# EAGLE design Precision Arduino (EAGLE 5.11)
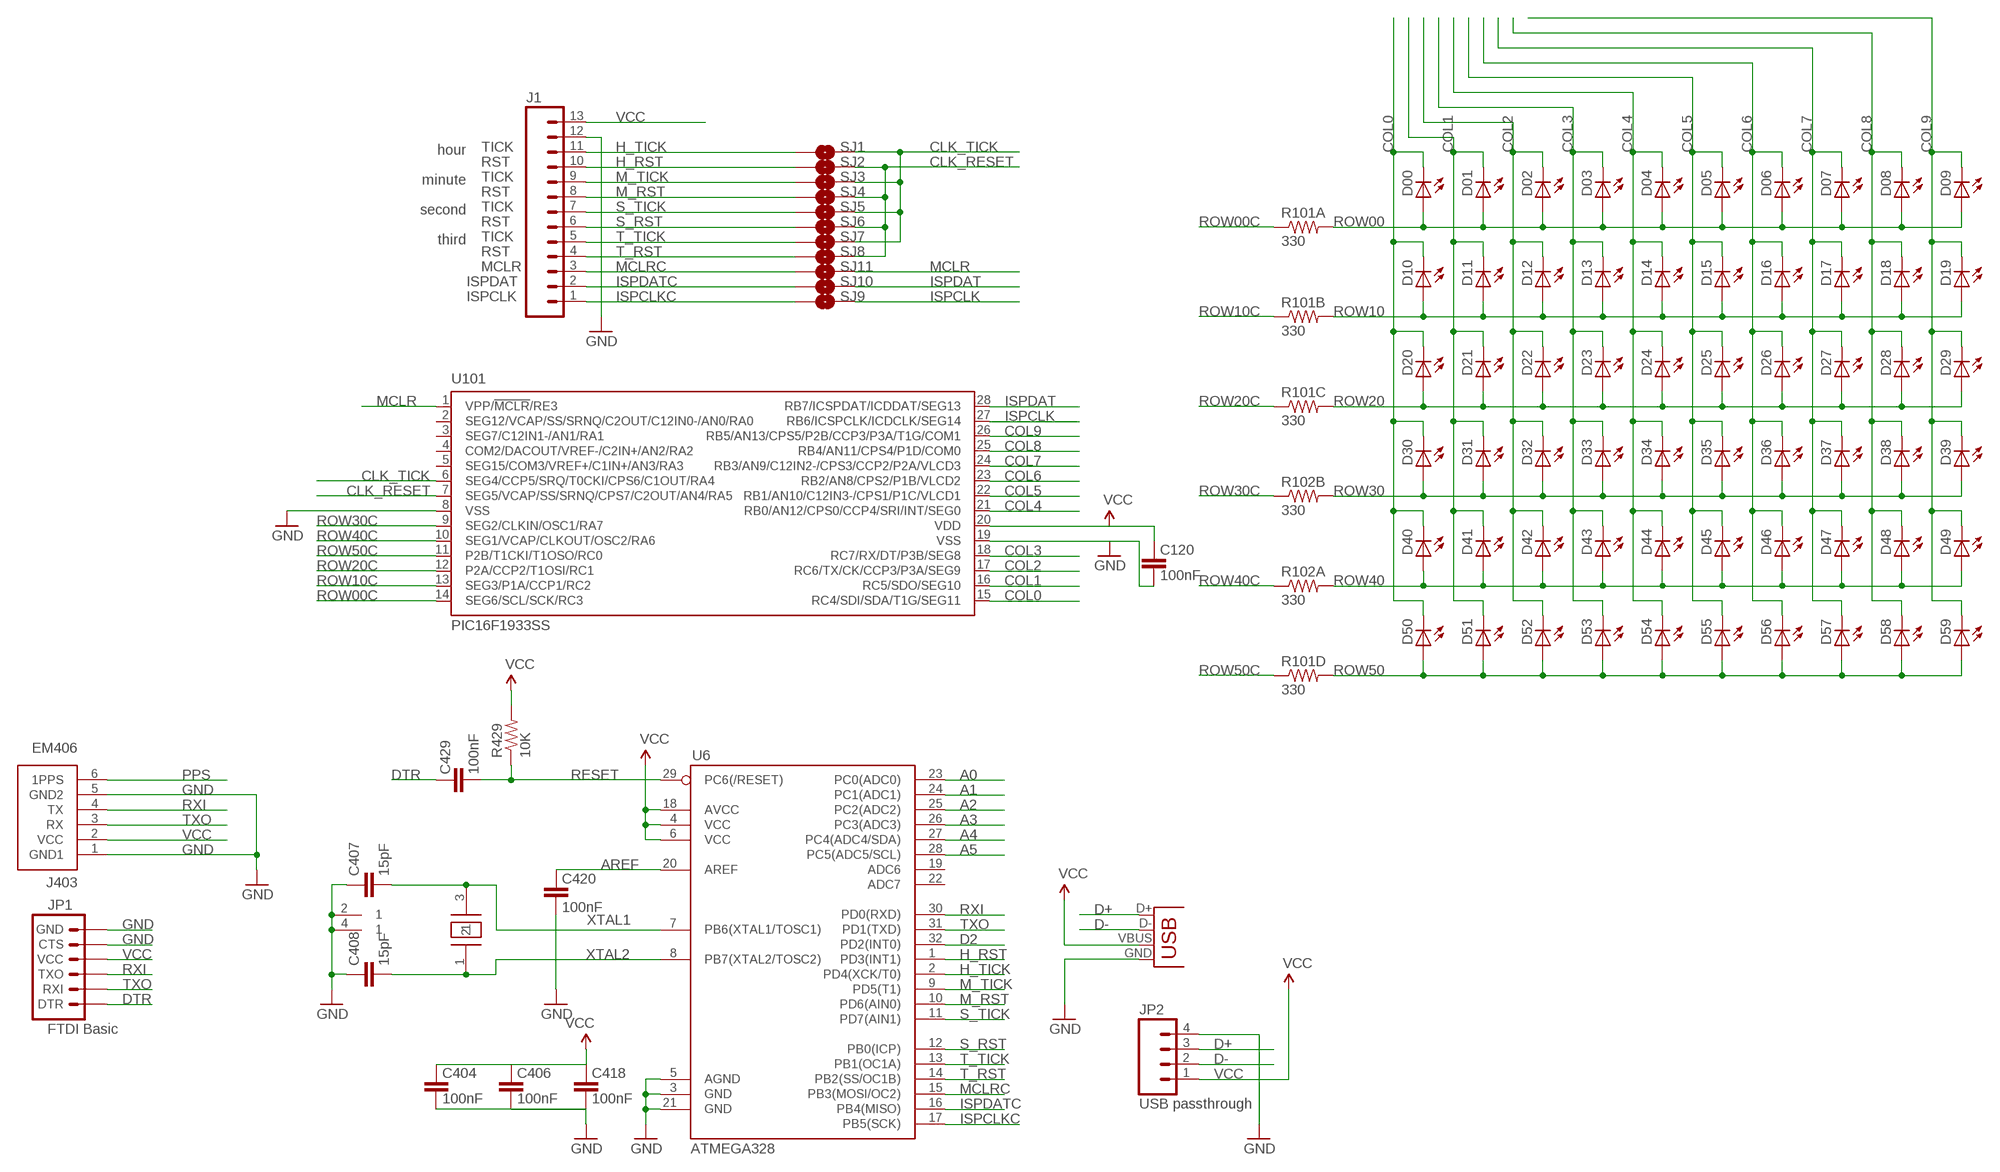
[diagram p0: schematic, sheet 1]

## Parts
C120  100nF  CAP0402-CAP  [0402-CAP]
C404  100nF  CAP0402-CAP  [0402-CAP]
C406  100nF  CAP0402-CAP  [0402-CAP]
C407  15pF  CAP0402-CAP  [0402-CAP]
C408  15pF  CAP0402-CAP  [0402-CAP]
C418  100nF  CAP0402-CAP  [0402-CAP]
C420  100nF  CAP0402-CAP  [0402-CAP]
C429  100nF  CAP0402-CAP  [0402-CAP]
D00  LED3MM  [LED3MM]
D01  LED3MM  [LED3MM]
D02  LED3MM  [LED3MM]
D03  LED3MM  [LED3MM]
D04  LED3MM  [LED3MM]
D05  LED3MM  [LED3MM]
D06  LED3MM  [LED3MM]
D07  LED3MM  [LED3MM]
D08  LED3MM  [LED3MM]
D09  LED3MM  [LED3MM]
D10  LED3MM  [LED3MM]
D11  LED3MM  [LED3MM]
D12  LED3MM  [LED3MM]
D13  LED3MM  [LED3MM]
D14  LED3MM  [LED3MM]
D15  LED3MM  [LED3MM]
D16  LED3MM  [LED3MM]
D17  LED3MM  [LED3MM]
D18  LED3MM  [LED3MM]
D19  LED3MM  [LED3MM]
D20  LED3MM  [LED3MM]
D21  LED3MM  [LED3MM]
D22  LED3MM  [LED3MM]
D23  LED3MM  [LED3MM]
D24  LED3MM  [LED3MM]
D25  LED3MM  [LED3MM]
D26  LED3MM  [LED3MM]
D27  LED3MM  [LED3MM]
D28  LED3MM  [LED3MM]
D29  LED3MM  [LED3MM]
D30  LED3MM  [LED3MM]
D31  LED3MM  [LED3MM]
D32  LED3MM  [LED3MM]
D33  LED3MM  [LED3MM]
D34  LED3MM  [LED3MM]
D35  LED3MM  [LED3MM]
D36  LED3MM  [LED3MM]
D37  LED3MM  [LED3MM]
D38  LED3MM  [LED3MM]
D39  LED3MM  [LED3MM]
D40  LED3MM  [LED3MM]
D41  LED3MM  [LED3MM]
D42  LED3MM  [LED3MM]
D43  LED3MM  [LED3MM]
D44  LED3MM  [LED3MM]
D45  LED3MM  [LED3MM]
D46  LED3MM  [LED3MM]
D47  LED3MM  [LED3MM]
D48  LED3MM  [LED3MM]
D49  LED3MM  [LED3MM]
D50  LED3MM  [LED3MM]
D51  LED3MM  [LED3MM]
D52  LED3MM  [LED3MM]
D53  LED3MM  [LED3MM]
D54  LED3MM  [LED3MM]
D55  LED3MM  [LED3MM]
D56  LED3MM  [LED3MM]
D57  LED3MM  [LED3MM]
D58  LED3MM  [LED3MM]
D59  LED3MM  [LED3MM]
J1  M13  [1X13]
J403  EM406  [EM406]
JP1  FTDI Basic  ARDUINO_SERIAL_PROGRAMPTH  [1X06]
JP2  USB passthrough  M04PTH  [1X04]
R101  330  CRA06S-8  [RP4]
R102  330  CRA06S-8  [RP4]
R429  10K  RESISTOR0402-RES  [0402-RES]
SJ1  SOLDERJUMPERNO  [SJ_2S-NO]
SJ2  SOLDERJUMPERNO  [SJ_2S-NO]
SJ3  SOLDERJUMPERNO  [SJ_2S-NO]
SJ4  SOLDERJUMPERNO  [SJ_2S-NO]
SJ5  SOLDERJUMPERNO  [SJ_2S-NO]
SJ6  SOLDERJUMPERNO  [SJ_2S-NO]
SJ7  SOLDERJUMPERNO  [SJ_2S-NO]
SJ8  SOLDERJUMPERNO  [SJ_2S-NO]
SJ9  SOLDERJUMPERNO  [SJ_2S-NO]
SJ10  SOLDERJUMPERNO  [SJ_2S-NO]
SJ11  SOLDERJUMPERNO  [SJ_2S-NO]
U6  ATMEGA328  ATMEGA168  [TQFP32-08]
U101  PIC16F1933SS  [SSOP28]
X1  USB-MICROB  [USB-MICROB]
Y401  TSX-3225  [CRYSTAL_SMD]

## Nets
A0: U6.23(PC0(ADC0))
A1: U6.24(PC1(ADC1))
A2: U6.25(PC2(ADC2))
A3: U6.26(PC3(ADC3))
A4: U6.27(PC4(ADC4/SDA))
A5: U6.28(PC5(ADC5/SCL))
AREF: C420.2 U6.20(AREF)
CLK_RESET: SJ2.2 SJ4.2 SJ6.2 SJ8.2 U101.7(SEG5/VCAP/SS/SRNQ/CPS7/C2OUT/AN4/RA5)
CLK_TICK: SJ1.2 SJ3.2 SJ5.2 SJ7.2 U101.6(SEG4/CCP5/SRQ/T0CKI/CPS6/C1OUT/RA4)
COL0: D00.K(C) D10.K(C) D20.K(C) D30.K(C) D40.K(C) D50.K(C) U101.15(RC4/SDI/SDA/T1G/SEG11)
COL1: D01.K(C) D11.K(C) D21.K(C) D31.K(C) D41.K(C) D51.K(C) U101.16(RC5/SDO/SEG10)
COL2: D02.K(C) D12.K(C) D22.K(C) D32.K(C) D42.K(C) D52.K(C) U101.17(RC6/TX/CK/CCP3/P3A/SEG9)
COL3: D03.K(C) D13.K(C) D23.K(C) D33.K(C) D43.K(C) D53.K(C) U101.18(RC7/RX/DT/P3B/SEG8)
COL4: D04.K(C) D14.K(C) D24.K(C) D34.K(C) D44.K(C) D54.K(C) U101.21(RB0/AN12/CPS0/CCP4/SRI/INT/SEG0)
COL5: D05.K(C) D15.K(C) D25.K(C) D35.K(C) D45.K(C) D55.K(C) U101.22(RB1/AN10/C12IN3-/CPS1/P1C/VLCD1)
COL6: D06.K(C) D16.K(C) D26.K(C) D36.K(C) D46.K(C) D56.K(C) U101.23(RB2/AN8/CPS2/P1B/VLCD2)
COL7: D07.K(C) D17.K(C) D27.K(C) D37.K(C) D47.K(C) D57.K(C) U101.24(RB3/AN9/C12IN2-/CPS3/CCP2/P2A/VLCD3)
COL8: D08.K(C) D18.K(C) D28.K(C) D38.K(C) D48.K(C) D58.K(C) U101.25(RB4/AN11/CPS4/P1D/COM0)
COL9: D09.K(C) D19.K(C) D29.K(C) D39.K(C) D49.K(C) D59.K(C) U101.26(RB5/AN13/CPS5/P2B/CCP3/P3A/T1G/COM1)
D2: U6.32(PD2(INT0))
D+: JP2.3 X1.D+
D-: JP2.2 X1.D-
DTR: C429.2 JP1.1(DTR)
GND [power]: C120.1 C404.1 C406.1 C407.1 C408.1 C418.1 C420.1 J1.12 J403.1(GND1) J403.5(GND2) JP1.5(CTS) JP1.6(GND) JP2.4 U6.3(GND) U6.5(AGND) U6.21(GND) U101.8(VSS) U101.19(VSS) X1.GND Y401.2 Y401.4
H_RST: J1.10 SJ2.1 U6.1(PD3(INT1))
H_TICK: J1.11 SJ1.1 U6.2(PD4(XCK/T0))
ISPCLK: SJ9.2 U101.27(RB6/ICSPCLK/ICDCLK/SEG14)
ISPCLKC: J1.1 SJ9.1 U6.17(PB5(SCK))
ISPDAT: SJ10.2 U101.28(RB7/ICSPDAT/ICDDAT/SEG13)
ISPDATC: J1.2 SJ10.1 U6.16(PB4(MISO))
M_RST: J1.8 SJ4.1 U6.10(PD6(AIN0))
M_TICK: J1.9 SJ3.1 U6.9(PD5(T1))
MCLR: SJ11.2 U101.1(VPP/!MCLR!/RE3)
MCLRC: J1.3 SJ11.1 U6.15(PB3(MOSI/OC2))
PPS: J403.6(1PPS)
RESET: C429.1 R429.1 U6.29(PC6(/RESET))
ROW00: D00.A D01.A D02.A D03.A D04.A D05.A D06.A D07.A D08.A D09.A R101.8
ROW00C: R101.1 U101.14(SEG6/SCL/SCK/RC3)
ROW10: D10.A D11.A D12.A D13.A D14.A D15.A D16.A D17.A D18.A D19.A R101.7
ROW10C: R101.2 U101.13(SEG3/P1A/CCP1/RC2)
ROW20: D20.A D21.A D22.A D23.A D24.A D25.A D26.A D27.A D28.A D29.A R101.6
ROW20C: R101.3 U101.12(P2A/CCP2/T1OSI/RC1)
ROW30: D30.A D31.A D32.A D33.A D34.A D35.A D36.A D37.A D38.A D39.A R102.7
ROW30C: R102.2 U101.9(SEG2/CLKIN/OSC1/RA7)
ROW40: D40.A D41.A D42.A D43.A D44.A D45.A D46.A D47.A D48.A D49.A R102.8
ROW40C: R102.1 U101.10(SEG1/VCAP/CLKOUT/OSC2/RA6)
ROW50: D50.A D51.A D52.A D53.A D54.A D55.A D56.A D57.A D58.A D59.A R101.5
ROW50C: R101.4 U101.11(P2B/T1CKI/T1OSO/RC0)
RXI: J403.4(TX) JP1.3(TXO) U6.30(PD0(RXD))
S_RST: J1.6 SJ6.1 U6.12(PB0(ICP))
S_TICK: J1.7 SJ5.1 U6.11(PD7(AIN1))
T_RST: J1.4 SJ8.1 U6.14(PB2(SS/OC1B))
T_TICK: J1.5 SJ7.1 U6.13(PB1(OC1A))
TXO: J403.3(RX) JP1.2(RXI) U6.31(PD1(TXD))
VCC [power]: C120.2 C404.2 C406.2 C418.2 J1.13 J403.2(VCC) JP1.4(VCC) JP2.1 R429.2 U6.4(VCC) U6.6(VCC) U6.18(AVCC) U101.20(VDD) X1.VBUS
XTAL1: C407.2 U6.7(PB6(XTAL1/TOSC1)) Y401.3
XTAL2: C408.2 U6.8(PB7(XTAL2/TOSC2)) Y401.1
Unconnected: R102.3 R102.4 R102.5 R102.6 U6.19(ADC6) U6.22(ADC7) U101.2(SEG12/VCAP/SS/SRNQ/C2OUT/C12IN0-/AN0/RA0) U101.3(SEG7/C12IN1-/AN1/RA1) U101.4(COM2/DACOUT/VREF-/C2IN+/AN2/RA2) U101.5(SEG15/COM3/VREF+/C1IN+/AN3/RA3)

## Notes on the sheet
- hour
- TICK
- RST
- minute
- TICK
- RST
- second
- TICK
- RST
- third
- TICK
- RST
- MCLR
- ISPDAT
- ISPCLK

## Library data of the parts
C120 C404 C406-C408 C418 C420 C429 = SparkFun:CAP: Capacitor Standard 0603 ceramic capacitor, and 0.1" leaded capacitor.
D00 D01-D09 D10-D59 = SparkFun:LED: LEDs Standard schematic elements and footprints for 5mm, 3mm, 1206, and 0603 sized LEDs. 5mm - Spark Fun Electronics SKU : COM-00529 (and others)
J1 = SparkFun:M13
J403 = SparkFun:EM406: EM406 Connector Proven layout and schematic for EM406 connector. Spark Fun Electronics SKU : GPS-00579
JP1 = SparkFun:ARDUINO_SERIAL_PROGRAM
JP2 = SparkFun:M04: Header 4 Standard 4-pin 0.1" header. Use with straight break away headers (SKU : PRT-00116), right angle break away headers (PRT-00553), swiss pins (PRT-00743), machine pins (PRT-00117), and female headers (PRT-00115). Molex polarized connector foot print use with SKU : PRT-08231 with associated crimp pins and housings. 1MM SMD Version SKU: PRT-10208
R101 R102 = KwanSystems:CRA06S-8
R429 = SparkFun:RESISTOR: Resistor Basic schematic elements and footprints for 0603, 1206, and PTH resistors.
SJ1-SJ11 = SparkFun:SOLDERJUMPER: Solder Jumper Standard SMD solder jumper. Used to automate production. Two varients : Normally Open and Normally Closed are the same, but have different paste layers. NC will have a large amount of paste and should jumper during reflow.
U6 = SparkFun:ATMEGA168
U101 = microchip:PIC16F19*: Flash-Based, 8-Bit CMOS Microcontrollers wtih LCD Driver and nanoWatt XLP Technology Auto generated by make-symbol-device-package-bsdl.ulp Rev. 33 Source: http://ww1.microchip.com/downloads/en/DeviceDoc/41364D.pdf; MPN: PIC16F1933T-I/SS; OC_FARNELL: 1755815; OC_NEWARK: 08R1942
X1 = SparkFun:USB: USB Connectors USB-B-PTH is fully proven SKU : PRT-00139 USB-miniB is fully proven SKU : PRT-00587 USB-A-PCB is untested. USB-A-H is throughly reviewed, but untested. Spark Fun Electronics SKU : PRT-00437 USB-B-SMT is throughly reviewed, but untested. Needs silkscreen touching up. USB-A-S has not been used/tested USB-MB-H has not been used/tested
Y401 = KwanSystems:TSX-3225

## Net classes
0 default: width 0.152 mm, drill 0.33 mm, clearance 0.152 mm
1 power: width 0.152 mm, drill 0.33 mm, clearance 0.152 mm to class 0, clearance 0.152 mm
2 hv: width 0.152 mm, drill 0.33 mm, clearance 0.152 mm to class 0, clearance 0.152 mm to class 1, clearance 0.152 mm

## Board
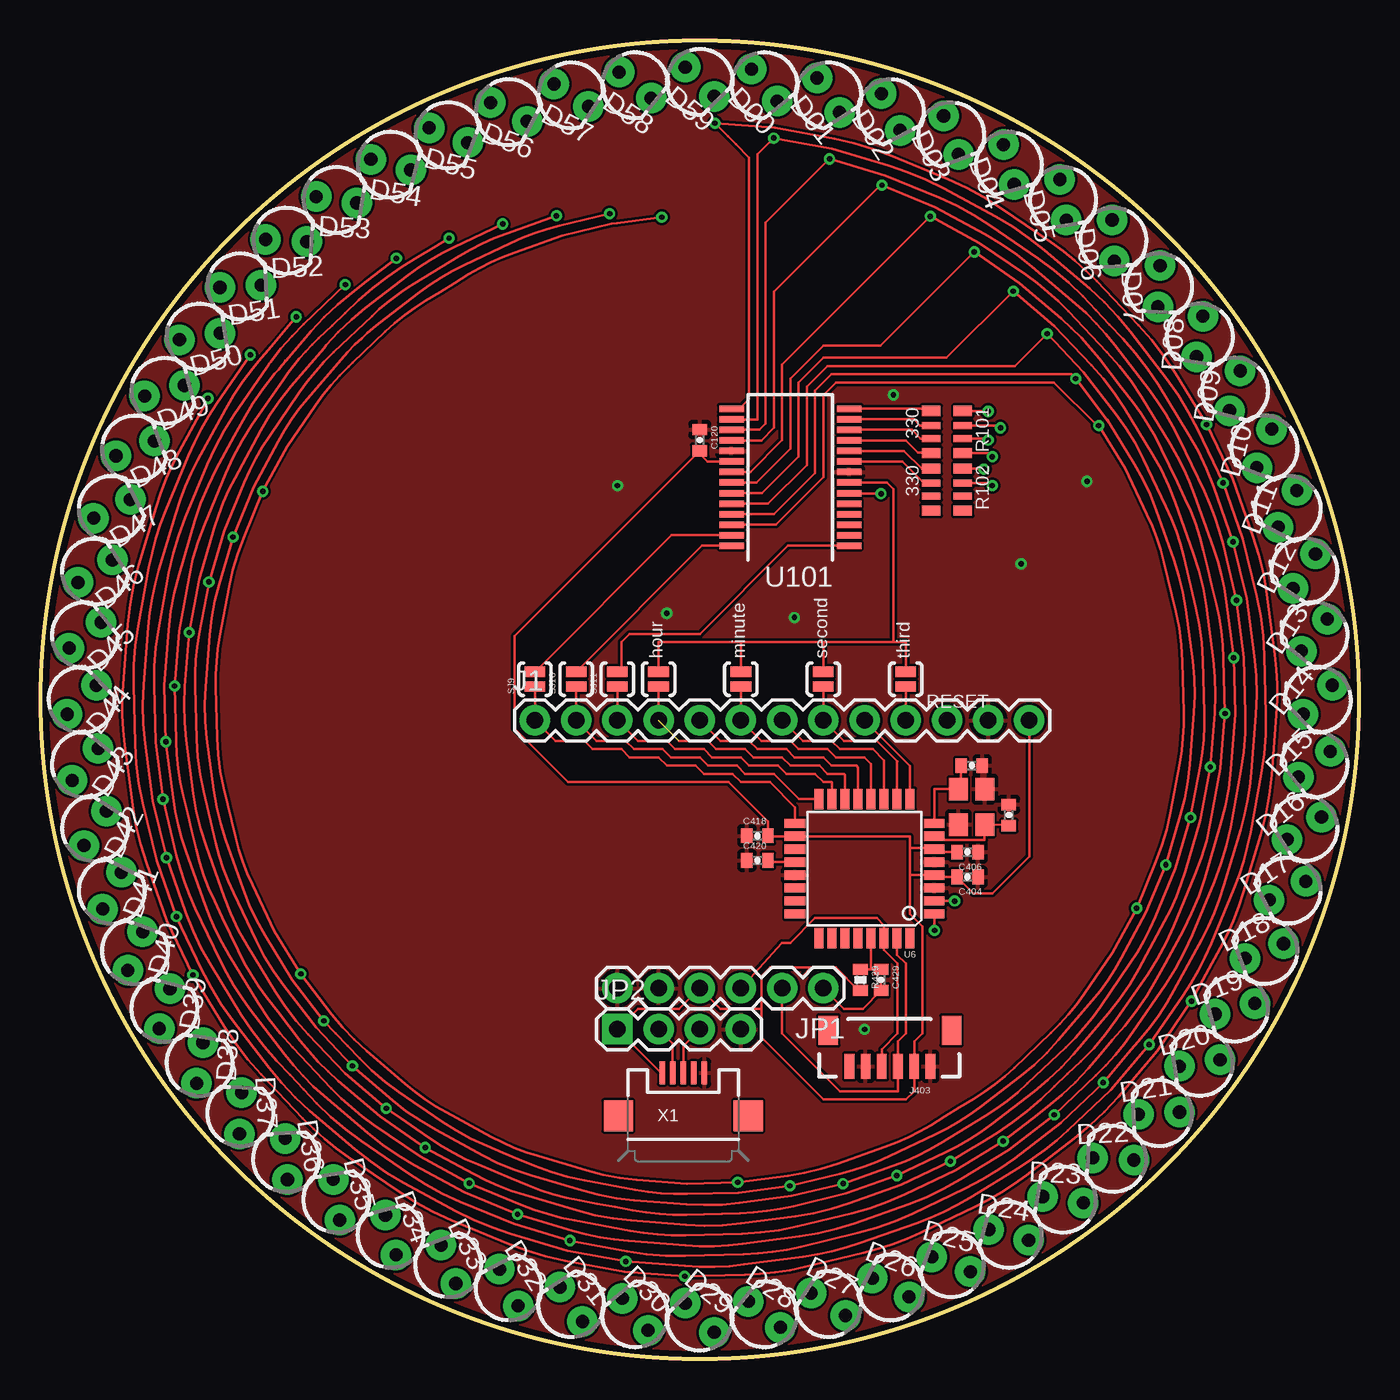
[diagram p1: board, top side]
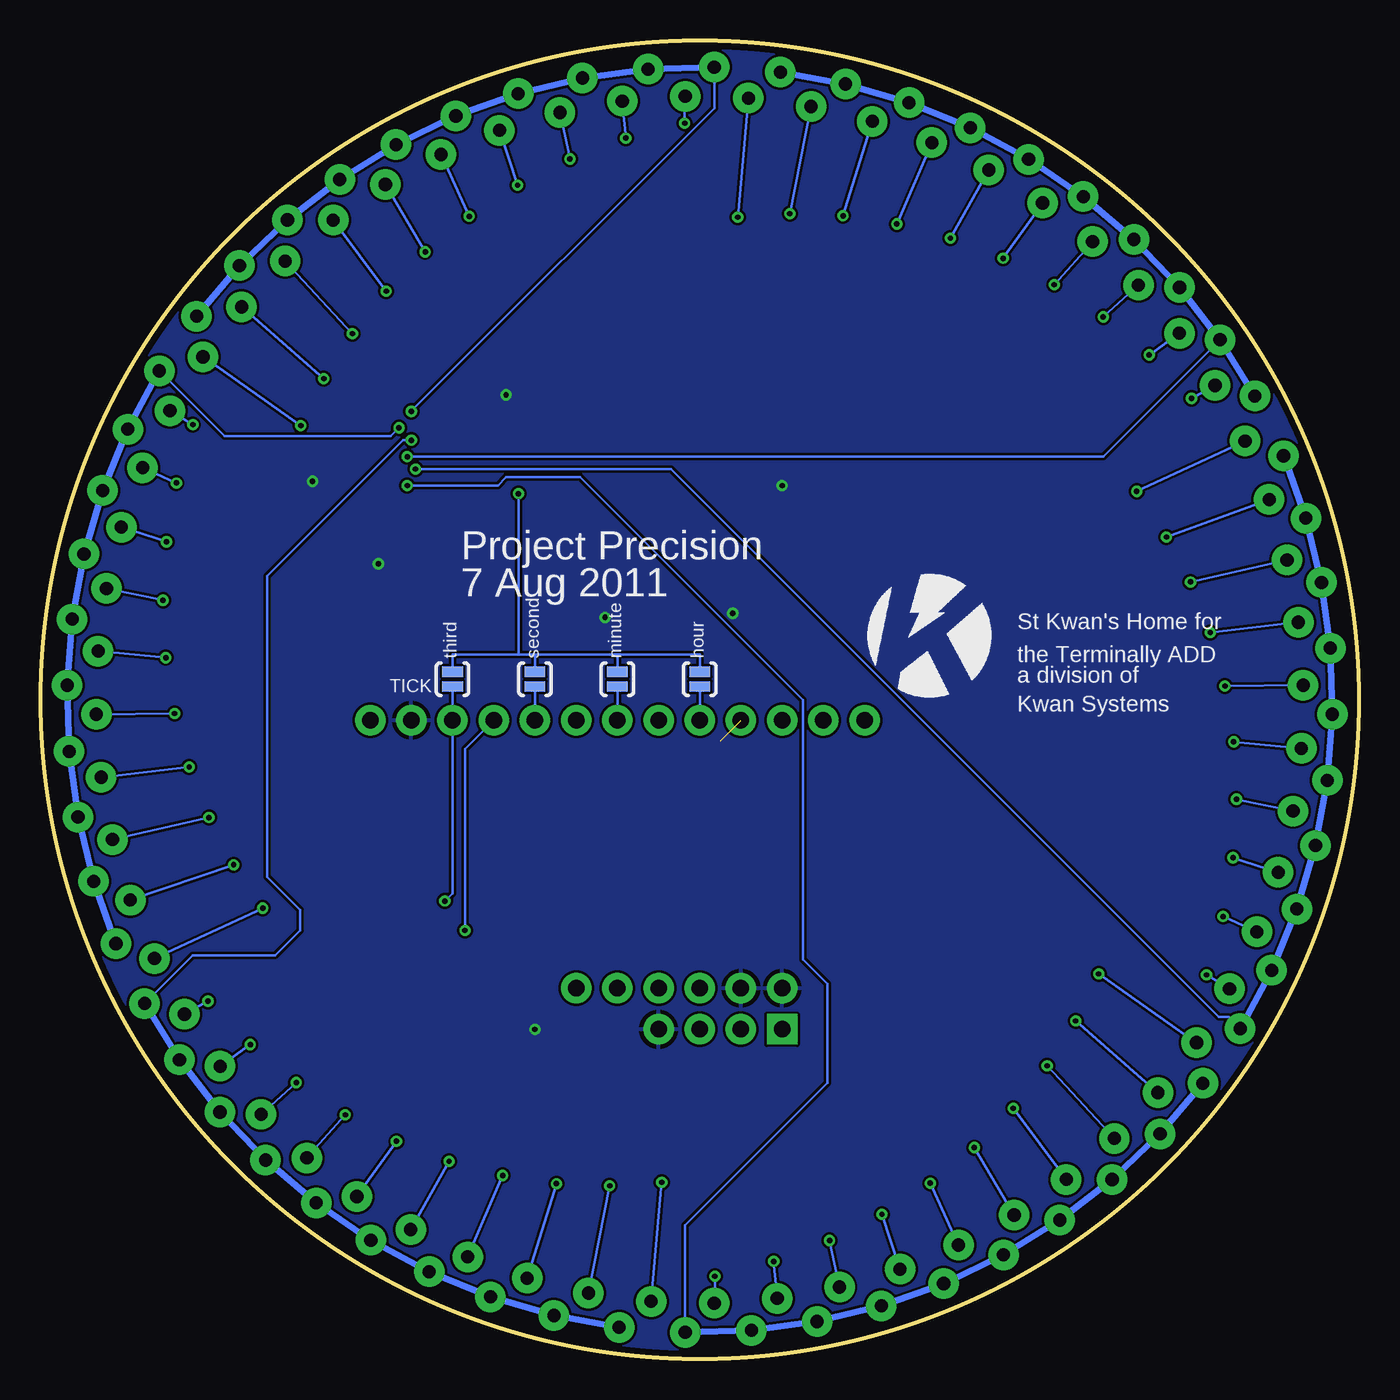
[diagram p2: board, bottom side, seen from below]

Size 81.28 x 81.28 mm. Coordinates in mm from the lower left corner, seen from the top.
Outline: circle at 40.64,40.64 radius 40.64
Copper layers (1*16): Top 0.0356mm / dielectric 1.5011mm / Bottom 0.0356mm
Design rules: minimum track width 6mil, minimum drill 13mil, track to track 6mil, track to pad 6mil, pad to pad 6mil, via to via 6mil, smd to smd 6mil, copper to edge 15mil, drill to drill 6mil, minimum pad ring 7mil, minimum via ring 7mil, stop-mask expansion 4mil, vias tented up to drill 0mil, thermal gap 10mil

### Footprints (pad centres in the part's own frame; a part is rotated, then mirrored left to right if it is on the bottom)
0402-CAP = smd 0.7 x 0.9: 1 -0.65,0; 2 0.65,0
LED3MM = drill 0.813 pad 1.88: A -1.27,0; K 1.27,0
1X13 = drill 1.016 pad 1.88: 1 0,0; 2 2.54,0; 3 5.08,0; 4 7.62,0; 5 10.16,0; 6 12.7,0; 7 15.24,0; 8 17.78,0; 9 20.32,0; 10 22.86,0; 11 25.4,0; 12 27.94,0; 13 30.48,0
EM406 = smd 0.6 x 1.55: 1 0,0; 2 1,0; 3 2,0; 4 3,0; 5 4,0; 6 5,0 | smd 1.2 x 1.8: P$1 -1.3,-2.225; P$2 6.3,-2.225
1X06 = drill 1.016 pad 1.88: 1 0,0; 2 2.54,0; 3 5.08,0; 4 7.62,0; 5 10.16,0; 6 12.7,0
1X04 = drill 1.016 pad 1.88 square: 1 0,0 | drill 1.016 pad 1.88: 2 2.54,0; 3 5.08,0; 4 7.62,0
CRA06 = smd 0.63 x 1.15: 1 -1.295,-0.975; 4 1.295,-0.975; 5 1.295,0.975; 8 -1.295,0.975 | smd 0.44 x 1.15: 2 -0.4,-0.975; 3 0.4,-0.975; 6 0.4,0.975; 7 -0.4,0.975
0402-RES = smd 0.7 x 0.9: 1 -0.65,0; 2 0.65,0
SJ_2S-NO = smd 0.635 x 1.27: 1 -0.45,0; 2 0.45,0
TQFP32-08 = smd 1.27 x 0.559: 1 -4.293,2.8; 2 -4.293,2; 3 -4.293,1.2; 4 -4.293,0.4; 5 -4.293,-0.4; 6 -4.293,-1.2; 7 -4.293,-2; 8 -4.293,-2.8; 17 4.293,-2.8; 18 4.293,-2; 19 4.293,-1.2; 20 4.293,-0.4; 21 4.293,0.4; 22 4.293,1.2; 23 4.293,2; 24 4.293,2.8 | smd 0.559 x 1.27: 9 -2.8,-4.293; 10 -2,-4.293; 11 -1.2,-4.293; 12 -0.4,-4.293; 13 0.4,-4.293; 14 1.2,-4.293; 15 2,-4.293; 16 2.8,-4.293; 25 2.8,4.293; 26 2,4.293; 27 1.2,4.293; 28 0.4,4.293; 29 -0.4,4.293; 30 -1.2,4.293; 31 -2,4.293; 32 -2.8,4.293
SSOP28 = smd 0.4 x 1.5: 1 -4.225,-3.625; 2 -3.575,-3.625; 3 -2.925,-3.625; 4 -2.275,-3.625; 5 -1.625,-3.625; 6 -0.975,-3.625; 7 -0.325,-3.625; 8 0.325,-3.625; 9 0.975,-3.625; 10 1.625,-3.625; 11 2.275,-3.625; 12 2.925,-3.625; 13 3.575,-3.625; 14 4.225,-3.625; 15 4.225,3.625; 16 3.575,3.625; 17 2.925,3.625; 18 2.275,3.625; 19 1.625,3.625; 20 0.975,3.625; 21 0.325,3.625; 22 -0.325,3.625; 23 -0.975,3.625; 24 -1.625,3.625; 25 -2.275,3.625; 26 -2.925,3.625; 27 -3.575,3.625; 28 -4.225,3.625
USB-MICROB = smd 0.35 x 1.4: D+ 0,2.65; D- -0.65,2.65; GND 1.3,2.65; ID 0.65,2.65; VBUS -1.3,2.65 | smd 1.8 x 1.9: MT1 -4,0; MT2 4,0
CRYSTAL_SMD = smd 1.4 x 1.15: 1 -1.092,-0.813; 2 1.092,-0.813; 3 1.092,0.813; 4 -1.092,0.813

### Placement (x,y rotation side)
C120  40.64,56.64 270 top
C404  57.15,29.72 180 top
C406  57.15,31.24 180 top
C407  59.69,33.53 270 top
C408  57.4,36.58 180 top
C418  44.2,32.26 0 top
C420  44.2,30.73 0 top
C429  51.82,23.37 270 top
D00  40.64,78.74 315 top
D01  44.62,78.53 309 top
D02  48.56,77.91 303 top
D03  52.41,76.88 297 top
D04  56.14,75.45 291 top
D05  59.69,73.63 285 top
D06  63.04,71.46 279 top
D07  66.13,68.95 273 top
D08  68.95,66.13 267 top
D09  71.46,63.04 261 top
D10  73.63,59.69 255 top
D11  75.45,56.14 249 top
D12  76.88,52.41 243 top
D13  77.91,48.56 237 top
D14  78.53,44.62 231 top
D15  78.74,40.64 225 top
D16  78.53,36.66 219 top
D17  77.91,32.72 213 top
D18  76.88,28.87 207 top
D19  75.45,25.14 201 top
D20  73.63,21.59 195 top
D21  71.46,18.24 189 top
D22  68.95,15.15 183 top
D23  66.13,12.33 177 top
D24  63.04,9.82 171 top
D25  59.69,7.65 165 top
D26  56.14,5.83 159 top
D27  52.41,4.4 153 top
D28  48.56,3.37 147 top
D29  44.62,2.75 141 top
D30  40.64,2.54 135 top
D31  36.66,2.75 129 top
D32  32.72,3.37 123 top
D33  28.87,4.4 117 top
D34  25.14,5.83 111 top
D35  21.59,7.65 105 top
D36  18.24,9.82 99 top
D37  15.15,12.33 93 top
D38  12.33,15.15 87 top
D39  9.82,18.24 81 top
D40  7.65,21.59 75 top
D41  5.83,25.14 69 top
D42  4.4,28.87 63 top
D43  3.37,32.72 57 top
D44  2.75,36.66 51 top
D45  2.54,40.64 45 top
D46  2.75,44.62 39 top
D47  3.37,48.56 33 top
D48  4.4,52.41 27 top
D49  5.83,56.14 21 top
D50  7.65,59.69 15 top
D51  9.82,63.04 9 top
D52  12.33,66.13 3 top
D53  15.15,68.95 357 top
D54  18.24,71.46 351 top
D55  21.59,73.63 345 top
D56  25.14,75.45 339 top
D57  28.87,76.88 333 top
D58  32.72,77.91 327 top
D59  36.66,78.53 321 top
J1  30.48,39.37 0 top
J403  54.86,18.03 180 top
JP1  48.26,22.86 180 top
JP2  35.56,20.32 0 top
R101  330  [CRA06]  55.88,57.15 270 top
R102  330  [CRA06]  55.88,53.59 270 top
R429  50.55,23.37 270 top
SJ1  55.88,41.91 90 bottom
SJ2  53.34,41.91 90 top
SJ3  50.8,41.91 90 bottom
SJ4  48.26,41.91 90 top
SJ5  45.72,41.91 90 bottom
SJ6  43.18,41.91 90 top
SJ7  40.64,41.91 90 bottom
SJ8  38.1,41.91 90 top
SJ9  30.48,41.91 90 top
SJ10  33.02,41.91 90 top
SJ11  35.56,41.91 90 top
U6  50.8,30.23 180 top
U101  46.23,54.36 90 top
X1  39.62,14.99 0 top
Y401  57.4,34.04 270 top

### Tracks (layer width: path | path; a pad name or v marks a point on that pad's centre or on a via)
AREF
  Top 0.152: U6.20 44.95,30.63 arc-90 C420.2
CLK_RESET
  Top 0.152: SJ8.2 38.1,44.2 43.18,44.2 | 43.18,44.2 SJ6.2 | SJ2.2 53.34,44.2 52.58,44.2 | 43.18,44.2 48.26,44.2 | 48.26,44.2 52.58,44.2 | 52.58,44.2 52.58,53.63 52.18,54.03 U101.7 | 48.26,44.2 SJ4.2
CLK_TICK  (via drill 0.33)
  Top 0.152: U101.6 49.89,53.34 v51.82,53.34
  Bottom 0.152: SJ7.2 40.64,43.43 45.72,43.43 | 45.72,43.43 SJ5.2 | 50.8,43.43 SJ3.2 | SJ1.2 55.88,43.43 51.82,43.43 | 45.72,43.43 50.8,43.43 | 51.82,43.43 v51.82,53.34 | 50.8,43.43 51.82,43.43
COL0  (via drill 0.33)
  Top 0.152: v10.32,59.22 8.54,55.95 arc12 7.12,52.51 6.06,48.94 arc12 5.38,45.28 5.09,41.57 arc12 5.19,37.85 5.67,34.16 arc12 6.55,30.54 7.79,27.03 v9.39,23.67 11.33,20.5 arc12 13.6,17.55 16.16,14.85 arc12 18.99,12.43 22.06,10.32 arc12 25.33,8.54 28.77,7.12 arc12 32.34,6.06 36,5.38 v39.71,5.09 43.43,5.19 arc12 47.12,5.67 50.74,6.55 arc12 54.25,7.79 57.61,9.39 arc12 60.78,11.33 63.73,13.6 arc12 66.43,16.16 68.85,18.99 v70.96,22.06 72.73,25.33 arc12 74.16,28.77 75.22,32.34 arc12 75.89,36 76.19,39.71 arc12 76.09,43.43 75.61,47.12 arc12 74.73,50.74 73.49,54.25 v71.89,57.61 69.95,60.78 arc12 67.68,63.73 65.12,66.43 arc12 62.29,68.85 59.22,70.96 arc12 55.95,72.73 52.51,74.16 arc12 48.94,75.22 45.28,75.89 v41.57,76.19 42.37,75.39 42.88,74.88 43.69,74.07 43.69,59.18 43.09,58.58 U101.15
  Bottom 0.152: v41.57,76.19 D00.K | v71.89,57.61 D10.K | v70.96,22.06 D20.K | v39.71,5.09 D30.K | D40.K v9.39,23.67 | D50.K v10.32,59.22 10.39,59.21
COL1  (via drill 0.33)
  Top 0.152: v12.93,61.9 10.86,58.89 arc12 9.12,55.68 7.72,52.3 arc12 6.68,48.79 6.01,45.2 arc12 5.73,41.55 5.82,37.9 arc12 6.3,34.27 7.15,30.72 v8.37,27.27 9.95,23.98 arc12 11.86,20.86 14.08,17.96 arc12 16.6,15.31 19.38,12.93 arc12 22.39,10.86 25.6,9.12 arc12 28.98,7.72 32.49,6.68 v36.08,6.01 39.73,5.73 arc12 43.38,5.82 47.01,6.3 arc12 50.56,7.15 54.01,8.37 arc12 57.3,9.95 60.42,11.86 arc12 63.32,14.08 65.97,16.6 v68.35,19.38 70.42,22.39 arc12 72.16,25.6 73.56,28.98 arc12 74.6,32.49 75.27,36.08 arc12 75.55,39.73 75.46,43.38 arc12 74.98,47.01 74.13,50.56 v72.91,54.01 71.33,57.3 arc12 69.42,60.42 67.2,63.32 arc12 64.68,65.97 61.9,68.35 arc12 58.89,70.42 55.68,72.16 arc12 52.3,73.56 48.79,74.6 v45.2,75.27 | v45.2,75.27 44.96,75.02 | 44.2,57.91 44.2,74.26 v45.2,75.27 | 44.2,57.91 44.19,57.9 | U101.16 42.62,57.91 44.2,57.91
  Bottom 0.152: v45.2,75.27 D01.K | v72.91,54.01 D11.K | v68.35,19.38 D21.K | v36.08,6.01 D31.K | D41.K v8.37,27.27 | v12.93,61.9 D51.K
COL2  (via drill 0.33)
  Top 0.152: v15.77,64.24 arc0 13.44,61.51 arc2 13.06,61.06 arc10 11.4,58.56 9.69,55.4 arc12 8.32,52.09 7.3,48.65 arc12 6.64,45.12 6.36,41.54 arc12 6.46,37.95 6.92,34.39 v7.76,30.9 8.96,27.52 arc12 10.51,24.28 arc0 12.38,21.22 arc12 14.57,18.37 arc0 17.04,15.77 arc12 19.77,13.44 22.72,11.4 arc12 25.88,9.69 29.2,8.32 v32.63,7.3 36.16,6.64 arc12 39.74,6.36 43.33,6.46 arc12 46.89,6.92 50.38,7.76 arc12 53.76,8.96 57,10.51 arc12 60.06,12.38 62.91,14.57 v65.51,17.04 arc0 67.84,19.77 arc12 69.88,22.72 71.59,25.88 arc12 72.96,29.2 73.98,32.63 arc12 74.64,36.16 74.92,39.74 arc12 74.82,43.33 74.36,46.89 v73.52,50.38 72.32,53.76 arc12 70.78,57 arc0 68.9,60.06 arc12 66.71,62.91 arc0 64.24,65.51 arc12 61.51,67.84 58.56,69.88 arc12 55.4,71.59 52.09,72.96 v48.65,73.98 44.7,70.04 44.7,57.66 44.33,57.28 U101.17
  Bottom 0.152: v48.65,73.98 D02.K | v73.52,50.38 D12.K | v65.51,17.04 D22.K | v32.63,7.3 D32.K | D42.K v7.76,30.9 | v15.77,64.24 D52.K
COL3  (via drill 0.33)
  Top 0.152: 74.19,43.25 74.28,39.76 arc-12 74.01,36.25 73.36,32.78 arc-12 72.36,29.41 71.02,26.15 arc-12 69.33,23.06 67.34,20.15 arc-12 65.05,17.47 v62.5,15.05 59.7,12.9 56.7,11.06 arc-12 53.52,9.55 50.2,8.37 arc-12 46.77,7.55 43.28,7.09 arc-12 39.76,7 36.25,7.27 arc-12 32.78,7.92 v29.41,8.91 26.15,10.26 23.06,11.95 arc-12 20.15,13.94 17.47,16.23 arc-12 15.05,18.78 12.9,21.58 arc-12 11.06,24.58 9.55,27.76 arc-12 8.37,31.08 v7.55,34.51 7.09,38 7,41.52 arc-12 7.27,45.03 7.92,48.5 arc-12 8.91,51.87 10.26,55.13 arc-12 11.95,58.22 13.94,61.13 arc-1 14.18,61.47 arc-11 16.23,63.81 v18.78,66.23 | 74.19,43.25 74.19,43.28 | 74.19,43.25 v73.73,46.77 72.91,50.2 arc12 71.73,53.52 70.22,56.7 arc12 68.38,59.7 66.23,62.5 arc12 63.81,65.05 61.13,67.34 arc12 58.22,69.33 55.13,71.02 v51.87,72.36 51.85,72.39 51.82,72.39 45.21,65.79 45.21,57.4 44.44,56.63 U101.18
  Bottom 0.152: v51.87,72.36 D03.K | v73.73,46.77 D13.K | v62.5,15.05 D23.K | v29.41,8.91 D33.K | v7.55,34.51 D43.K | v18.78,66.23 D53.K
COL4  (via drill 0.33)
  Top 0.152: 15.11,61.53 arc0 14.44,60.74 arc12 12.49,57.89 arc0 10.84,54.86 arc12 9.52,51.66 8.53,48.35 arc12 7.9,44.95 7.63,41.5 v7.72,38.05 8.17,34.62 arc12 8.98,31.26 10.13,28 arc12 11.62,24.88 13.43,21.94 arc12 15.53,19.2 17.91,16.69 arc12 20.54,14.44 23.39,12.49 v26.42,10.84 29.62,9.52 arc12 32.93,8.53 36.33,7.9 arc12 39.78,7.63 43.23,7.72 arc12 46.66,8.17 50.02,8.98 arc12 53.28,10.13 56.4,11.62 v59.34,13.43 arc0 62.09,15.53 arc11 64.59,17.91 arc1 66.84,20.54 arc12 68.79,23.39 arc0 70.44,26.42 arc12 71.77,29.62 72.75,32.93 arc12 73.38,36.33 73.65,39.78 v73.56,43.23 73.11,46.66 arc12 72.3,50.02 71.14,53.28 arc12 69.66,56.4 67.85,59.34 arc12 65.75,62.09 63.37,64.59 arc12 60.74,66.84 57.89,68.79 v54.86,70.44 45.72,61.31 45.72,56.64 43.76,54.68 U101.21 | 15.11,61.53 arc0 16.69,63.37 arc-11 19.2,65.75 arc0 v21.94,67.85 | 15.11,61.53 15.09,61.54
  Bottom 0.152: v54.86,70.44 D04.K | v73.56,43.23 D14.K | v59.34,13.43 D24.K | D34.K v26.42,10.84 | v7.72,38.05 D44.K | v21.94,67.85 D54.K
COL5  (via drill 0.33)
  Top 0.152: v25.19,69.1 arc0 22.3,67.33 arc12 19.61,65.27 arc0 17.15,62.93 arc6 15.95,61.66 arc6 14.95,60.35 13.03,57.56 arc12 11.41,54.58 10.11,51.45 arc12 9.15,48.2 8.53,44.87 v8.27,41.49 arc0 8.35,38.1 arc12 8.8,34.74 arc0 9.59,31.44 arc12 10.72,28.25 arc0 12.18,25.19 arc12 13.95,22.3 arc0 16.02,19.61 arc12 18.35,17.15 20.92,14.95 v23.72,13.03 26.7,11.41 arc12 29.83,10.11 33.08,9.15 arc12 36.41,8.53 39.79,8.27 arc12 43.18,8.35 46.54,8.8 arc12 49.84,9.59 53.03,10.72 v56.09,12.18 arc0 58.98,13.95 arc12 61.67,16.02 arc0 64.13,18.35 arc12 66.33,20.92 68.25,23.72 arc12 69.87,26.7 71.17,29.83 arc12 72.13,33.08 72.75,36.41 v73.02,39.79 arc0 72.93,43.18 arc12 72.48,46.54 arc0 71.69,49.84 arc12 70.56,53.03 arc0 69.1,56.09 arc12 67.33,58.98 arc0 65.27,61.67 arc12 62.93,64.13 60.35,66.33 v57.56,68.25 51.79,62.48 48.26,62.48 46.23,60.45 46.23,56.13 44.12,54.03 U101.22
  Bottom 0.152: v57.56,68.25 D05.K | v73.02,39.79 D15.K | v56.09,12.18 D25.K | D35.K v23.72,13.03 | v8.27,41.49 D45.K | v25.19,69.1 D55.K
COL6  (via drill 0.33)
  Top 0.152: 66.81,58.62 arc12 64.78,61.26 | 69.97,52.79 arc12 68.54,55.79 | 71.86,46.43 arc12 71.08,49.66 | 72.38,39.81 arc12 72.29,43.13 | v72.12,36.49 arc0 72.38,39.81 | 69.3,26.97 arc12 70.57,30.04 | 65.83,21.31 arc12 67.71,24.05 | 61.26,16.5 arc12 63.67,18.79 | 55.79,12.74 arc12 58.62,14.47 | 43.13,8.99 arc12 46.43,9.42 | 39.81,8.9 arc0 43.13,8.99 | 36.49,9.16 arc12 39.81,8.9 | 33.23,9.77 arc0 36.49,9.16 | 30.04,10.71 arc12 33.23,9.77 | 26.97,11.98 arc0 30.04,10.71 | 24.05,13.57 arc12 26.97,11.98 | v21.31,15.45 arc0 24.05,13.57 | 16.5,20.02 arc-12 14.47,22.66 | 12.74,25.49 arc-12 11.31,28.49 | 10.2,31.62 arc-12 9.42,34.85 | 8.99,38.15 arc-12 8.9,41.47 | 10.71,51.24 arc-12 11.98,54.31 | 13.57,57.23 arc-12 15.45,59.97 | 17.61,62.49 arc-12 20.02,64.78 | 22.66,66.81 arc-12 25.49,68.54 | 64.78,61.26 62.49,63.67 v59.97,65.83 55.86,61.72 48.26,61.72 46.74,60.2 46.74,55.63 44.49,53.38 U101.23 | 66.81,58.62 arc12 64.78,61.26 | 68.54,55.79 66.81,58.62 | 69.97,52.79 arc12 68.54,55.79 | 71.08,49.66 69.97,52.79 | 71.86,46.43 arc12 71.08,49.66 | 72.29,43.13 71.86,46.43 | 72.38,39.81 arc12 72.29,43.13 | v72.12,36.49 arc0 72.38,39.81 | 70.57,30.04 71.51,33.23 v72.12,36.49 | 69.3,26.97 arc12 70.57,30.04 | 67.71,24.05 69.3,26.97 | 65.83,21.31 arc12 67.71,24.05 | 63.67,18.79 65.83,21.31 | 61.26,16.5 arc12 63.67,18.79 | 58.62,14.47 61.26,16.5 | 55.79,12.74 arc12 58.62,14.47 | 55.79,12.74 v52.79,11.31 49.66,10.2 46.43,9.42 | 43.13,8.99 arc12 46.43,9.42 | 39.81,8.9 arc0 43.13,8.99 | 36.49,9.16 arc12 39.81,8.9 | 33.23,9.77 arc0 36.49,9.16 | 30.04,10.71 arc12 33.23,9.77 | 26.97,11.98 arc0 30.04,10.71 | 24.05,13.57 arc12 26.97,11.98 | v21.31,15.45 arc0 24.05,13.57
  Top 0.152: 16.5,20.02 18.79,17.61 v21.31,15.45 | 16.5,20.02 arc-12 14.47,22.66 | 14.47,22.66 12.74,25.49 | 12.74,25.49 arc-12 11.31,28.49 | 11.31,28.49 10.2,31.62 | 10.2,31.62 arc-12 9.42,34.85 | 9.42,34.85 8.99,38.15 | 8.99,38.15 arc-12 8.9,41.47 | 8.9,41.47 v9.16,44.78 9.77,48.05 10.71,51.24 | 10.71,51.24 arc-12 11.98,54.31 | 11.98,54.31 13.57,57.23 | 13.57,57.23 arc-12 15.45,59.97 | 15.45,59.97 17.47,62.33 17.61,62.49 | 17.61,62.49 arc-12 20.02,64.78 | 20.02,64.78 22.66,66.81 | 22.66,66.81 arc-12 25.49,68.54 | 25.49,68.54 v28.49,69.97
  Bottom 0.152: v59.97,65.83 D06.K | v72.12,36.49 D16.K | v52.79,11.31 D26.K | D36.K v21.31,15.45 | v9.16,44.78 D46.K | v28.49,69.97 D56.K
COL7  (via drill 0.33)
  Top 0.152: v31.8,70.47 28.73,69.39 arc12 25.79,67.99 23.02,66.28 arc5 21.85,65.49 arc7 20.43,64.3 18.07,62.06 arc12 15.95,59.58 14.11,56.9 arc12 12.55,54.04 11.31,51.03 v10.38,47.9 9.79,44.7 arc12 9.54,41.45 9.62,38.2 arc12 10.05,34.97 10.8,31.8 arc12 11.89,28.73 13.29,25.79 arc12 15,23.02 16.98,20.43 v19.22,18.07 arc0 21.7,15.95 arc12 24.38,14.11 arc0 27.24,12.55 arc12 30.25,11.31 arc0 33.38,10.38 arc12 36.58,9.79 39.83,9.54 arc12 43.08,9.62 46.31,10.05 v49.48,10.8 52.55,11.89 arc12 55.49,13.29 58.26,15 arc12 60.85,16.98 63.21,19.22 arc12 65.33,21.7 67.17,24.38 arc12 68.72,27.24 69.97,30.25 v70.9,33.38 71.49,36.58 arc12 71.75,39.83 71.66,43.08 arc12 71.23,46.31 70.47,49.48 arc12 69.39,52.55 67.99,55.49 arc12 66.28,58.26 64.3,60.85 v62.06,63.21 60.06,61.21 48.51,61.21 47.24,59.94 47.24,55.12 44.86,52.73 U101.24
  Bottom 0.152: v62.06,63.21 D07.K | v70.9,33.38 D17.K | v49.48,10.8 D27.K | D37.K v19.22,18.07 | v31.8,70.47 D57.K | v10.38,47.9 D47.K
COL8  (via drill 0.33)
  Top 0.152: 65.89,57.69 67.43,55.18 arc-12 68.8,52.3 69.86,49.3 arc-12 70.61,46.2 71.03,43.03 arc-12 71.11,39.84 70.86,36.66 arc-12 70.28,33.53 v69.37,30.46 68.15,27.52 66.63,24.71 arc-12 64.82,22.09 62.75,19.66 arc-12 60.43,17.46 57.9,15.52 arc-12 55.18,13.85 52.3,12.48 arc-12 49.3,11.41 v46.2,10.67 43.03,10.25 39.84,10.17 arc-12 36.66,10.42 33.53,11 arc-12 30.46,11.91 arc0 27.52,13.13 arc-12 24.71,14.65 arc0 22.09,16.46 arc-12 19.66,18.53 arc0 v17.46,20.85 15.52,23.38 13.85,26.1 arc-12 12.48,28.98 11.41,31.98 arc-12 10.67,35.09 10.25,38.25 arc-12 10.17,41.44 10.42,44.62 arc-12 11,47.76 v11.87,50.67 | 65.89,57.69 65.76,57.9 | v11.87,50.67 11.91,50.81 | v35.09,70.61 31.98,69.86 arc12 28.98,68.8 26.1,67.43 arc12 23.38,65.76 20.85,63.82 arc5 19.81,62.95 arc7 18.53,61.62 16.46,59.2 arc12 14.65,56.57 13.13,53.76 v11.87,50.67 | 65.89,57.69 v63.82,60.43 63.55,60.71 48.77,60.71 47.75,59.69 47.75,54.61 45.22,52.08 U101.25
  Bottom 0.152: v63.82,60.43 D08.K | v69.37,30.46 D18.K | v46.2,10.67 D28.K | D38.K v17.46,20.85 | v35.09,70.61 D58.K | v11.87,50.67 D48.K
COL9  (via drill 0.33)
  Top 0.152: v38.3,70.39 35.54,70.03 35.2,69.98 32.16,69.26 29.22,68.21 arc12 26.4,66.87 arc0 23.74,65.23 arc12 21.26,63.34 19.23,61.41 18.99,61.18 arc12 16.96,58.81 15.19,56.23 v13.7,53.49 12.51,50.6 arc12 11.62,47.61 11.05,44.54 arc12 10.8,41.42 10.89,38.3 arc12 11.29,35.2 12.02,32.16 arc12 13.07,29.22 14.41,26.4 v16.05,23.74 17.95,21.26 arc12 20.1,18.99 22.47,16.96 arc12 25.05,15.19 27.79,13.7 arc12 30.68,12.51 33.67,11.62 arc12 36.74,11.05 39.86,10.8 v42.98,10.89 46.08,11.29 arc12 49.12,12.02 52.06,13.07 arc12 54.88,14.41 arc0 57.54,16.05 arc12 60.02,17.95 62.29,20.1 arc12 64.32,22.47 66.09,25.05 v67.58,27.79 68.77,30.68 arc12 69.66,33.67 70.23,36.74 arc12 70.47,39.86 70.39,42.98 arc12 69.98,46.08 69.26,49.12 arc12 68.21,52.06 66.87,54.88 v65.23,57.54 65.14,57.54 62.48,60.2 49.02,60.2 48.26,59.44 48.26,54.36 45.34,51.43 U101.26
  Bottom 0.152: v65.23,57.54 D09.K | v67.58,27.79 D19.K | v42.98,10.89 D29.K | D39.K v16.05,23.74 | v38.3,70.39 D59.K | v13.7,53.49 D49.K
D+
  Top 0.152: X1.D+ 39.62,19.3 JP2.3
D-
  Top 0.152: X1.D- 38.97,19.45 JP2.2
DTR
  Top 0.152: 51.82,23.37 C429.2 50.69,21.59 49.53,21.59 JP1.1
GND  (via drill 0.33)
  other vias: 50.8,20.32 52.58,59.44 60.45,49.02 46.48,45.72 38.61,45.97 64.52,54.1 35.56,53.85
  pour Top: 40.64,81.28 arc-90 81.28,40.64 arc-90 40.64,0 arc-90 0,40.64 arc-90
  pour Bottom: 40.64,81.28 arc-90 81.28,40.64 arc-90 40.64,0 arc-90 0,40.64 arc-90
H_RST  (via drill 0.33)
  Top 0.152: J1.10 SJ2.1 | U6.1 55.12,27.4 v55.12,26.42
  Bottom 0.152: v55.12,26.42 55.12,37.59 J1.10
H_TICK  (via drill 0.33)
  Top 0.152: 56.39,28.19 v56.36,28.23 U6.2
  Bottom 0.152: SJ1.1 J1.11 55.88,28.7 v56.36,28.23
ISPCLK
  Top 0.152: SJ9.2 38.9,50.78 U101.27
ISPCLKC
  Top 0.152: SJ9.1 J1.1 31.75,38.1 33.53,38.1 34.04,37.59 35.81,37.59 36.32,37.08 38.1,37.08 38.61,36.58 40.39,36.58 40.89,36.07 42.67,36.07 43.18,35.56 44.96,35.56 46.51,34.01 U6.17
ISPDAT
  Top 0.152: SJ10.2 40.79,50.13 U101.28
ISPDATC
  Top 0.152: SJ10.1 J1.2 34.29,38.1 36.07,38.1 36.58,37.59 38.35,37.59 38.86,37.08 40.64,37.08 41.15,36.58 42.93,36.58 43.43,36.07 45.21,36.07 46.76,34.52 U6.16
M_RST
  Top 0.152: SJ4.1 J1.8 49.53,38.1 51.56,38.1 52.83,36.83 52.8,36.8 U6.10
M_TICK
  Top 0.152: U6.9 53.6,36.57 J1.9
  Bottom 0.152: J1.9 SJ3.1
MCLR
  Top 0.152: SJ11.2 35.81,42.61 35.81,44.2 36.32,44.7 40.64,44.7 46.07,50.13 U101.1
MCLRC
  Top 0.152: SJ11.1 J1.3 36.83,38.1 38.61,38.1 39.12,37.59 40.89,37.59 41.4,37.08 43.18,37.08 43.69,36.58 45.47,36.58 45.97,36.07 47.75,36.07 48.26,35.56 48.77,35.56 48.8,35.53 U6.15
RESET
  Top 0.152: 51.2,24.02 C429.1 | U6.29 51.2,24.13 51.2,24.02 | 50.55,24.13 R429.1 51.2,24.02
ROW00  (via drill 0.33)
  Top 0.152: R101.8 58.4,58.45 v58.42,58.42
  Bottom 0.152: v58.42,58.42 39.74,77.1 D00.A
  Bottom 0.406: D00.A D01.A D02.A D03.A D04.A D05.A D06.A D07.A D08.A 69.09,67.31 D09.A
ROW00C
  Top 0.152: 54.8,58.55 R101.1 54.77,58.58 U101.14
ROW10  (via drill 0.33)
  Top 0.152: R101.7 59.04,57.55 v59.18,57.4
  Bottom 0.152: v59.18,57.4 59.69,56.9 69.94,56.9 D10.A
  Bottom 0.406: D10.A D11.A D12.A D13.A D14.A D15.A D16.A D17.A D18.A D19.A
ROW10C
  Top 0.152: R101.2 54.21,57.55 53.83,57.93 U101.13
ROW20  (via drill 0.33)
  Top 0.152: R101.6 58.31,56.75 v58.42,56.64
  Bottom 0.152: D20.A 71.89,24.89 66.8,24.89 65.28,26.42 65.28,27.69 67.31,29.72 67.31,48.26 58.93,56.64 v58.42,56.64
  Bottom 0.406: D20.A D21.A D22.A D23.A D24.A D25.A D26.A D27.A D28.A D29.A
ROW20C
  Top 0.152: R101.3 54.25,56.75 53.72,57.28 U101.12
ROW30  (via drill 0.33)
  Top 0.152: R102.7 58.53,53.99 v58.67,53.85
  Bottom 0.152: v58.67,53.85 53.09,53.85 52.58,54.36 48.01,54.36 34.29,40.64 34.29,24.64 32.77,23.11 32.77,17.02 41.54,8.25 D30.A
  Bottom 0.406: D39.A D38.A D37.A D36.A D35.A D34.A D33.A D32.A D31.A D30.A
ROW30C
  Top 0.152: R102.2 55.01,53.99 55.12,54.1 54.36,54.1 53.13,55.33 U101.9
ROW40  (via drill 0.33)
  Top 0.152: R102.8 58.14,54.89 v58.17,54.86
  Bottom 0.152: D40.A 8.04,21.08 8.64,21.08 42.42,54.86 v58.17,54.86
  Bottom 0.406: D49.A D48.A D47.A D46.A D45.A D44.A D43.A D42.A D41.A D40.A
ROW40C
  Top 0.152: R102.1 54.33,54.89 53.24,55.98 U101.10
ROW50  (via drill 0.33)
  Top 0.152: R101.5 58.45,55.85 v58.67,55.63
  Bottom 0.152: D51.A 8.56,62.81 15.75,55.63 v58.67,55.63
  Bottom 0.406: D59.A D58.A D57.A D56.A D55.A D54.A D53.A D52.A D51.A D50.A
ROW50C
  Top 0.152: R101.4 54.88,55.88 54.1,55.88 53.35,56.63 U101.11
RXI
  Top 0.152: J403.4 51.86,19.1 52.83,20.07 52.83,24.38 52,25.22 U6.30 52,26.74 51.56,27.18 47.75,27.18 46.23,25.65 45.72,25.65 JP1.3
S_RST
  Top 0.152: SJ6.1 J1.6 44.45,38.1 46.23,38.1 46.74,37.59 48.51,37.59 49.02,37.08 50.8,37.08 51.2,36.68 U6.12
S_TICK
  Top 0.152: U6.11 52,36.9 51.31,37.59 49.28,37.59 48.77,38.1 46.99,38.1 J1.7
  Bottom 0.152: J1.7 SJ5.1
T_RST  (1 unrouted)
  Top 0.152: J1.4 SJ8.1 | U6.14 49.6,36 49.53,36.07 48.51,36.07 48.01,36.58 46.23,36.58 45.72,37.08 43.94,37.08 43.43,37.59 41.66,37.59 41.15,38.1 39.37,38.1
T_TICK
  Top 0.152: U6.13 50.4,36.47 50.29,36.58 48.77,36.58 48.26,37.08 46.48,37.08 45.97,37.59 44.2,37.59 43.69,38.1 41.91,38.1 J1.5
  Bottom 0.152: J1.5 SJ7.1
TXO
  Top 0.152: U6.31 52.8,24.92 53.34,24.38 53.34,20.07 52.86,19.59 J403.3 52.86,16.51 49.28,16.51 45.72,20.07 JP1.2
VCC
  Top 0.152: 53.59,31.5 55.09,31.5 U6.6 55.28,31.24 C406.2 | 53.59,29.83 53.59,31.5 | 53.59,29.83 U6.4 55.2,29.72 C404.2 57.52,28.7 58.67,28.7 60.96,30.99 J1.13 | 53.59,31.5 53.59,32.23 U6.18 44.88,32.23 arc-90 C418.2 44.85,33.13 42.42,35.56 32.51,35.56 29.21,38.86 29.21,44.56 C120.2 40.64,55.8 41.11,55.33 U101.20 | 53.59,29.83 53.59,27.43 54.36,26.67 54.36,20.07 53.86,19.57 J403.2 53.86,16.51 53.36,16 48.26,16 44.45,19.81 44.45,21.59 | 50.4,22.72 R429.2 50.43,22.72 49.02,24.13 47.5,24.13 | X1.VBUS 38.24,17.64 JP2.1 36.83,21.59 39.37,21.59 JP1.4 41.91,21.59 44.45,21.59 | 47.5,24.13 46.99,23.62 | 44.45,21.59 44.45,23.62 44.96,24.13 47.5,24.13
XTAL1
  Top 0.152: U6.7 arc90 55.31,32 58.17,32 arc90 58.2,32.04 Y401.3 59.63,32.94 C407.2
XTAL2
  Top 0.152: U6.8 55.09,35.14 Y401.1 arc90 56.75,35.29 C408.2

### Text on the board
tPlace: hour | minute | second | third | RESET
bPlace: Project Precision | 7 Aug 2011 | St Kwan's Home for | the Terminally ADD | hour | minute | second | third | a division of | TICK | Kwan Systems